# EasyEDA schematic stm32_2.json
TITLE: 最小系统板; REV: 1.0; Date: 2022-09-15; Sheet: 1/1; Company: cxj
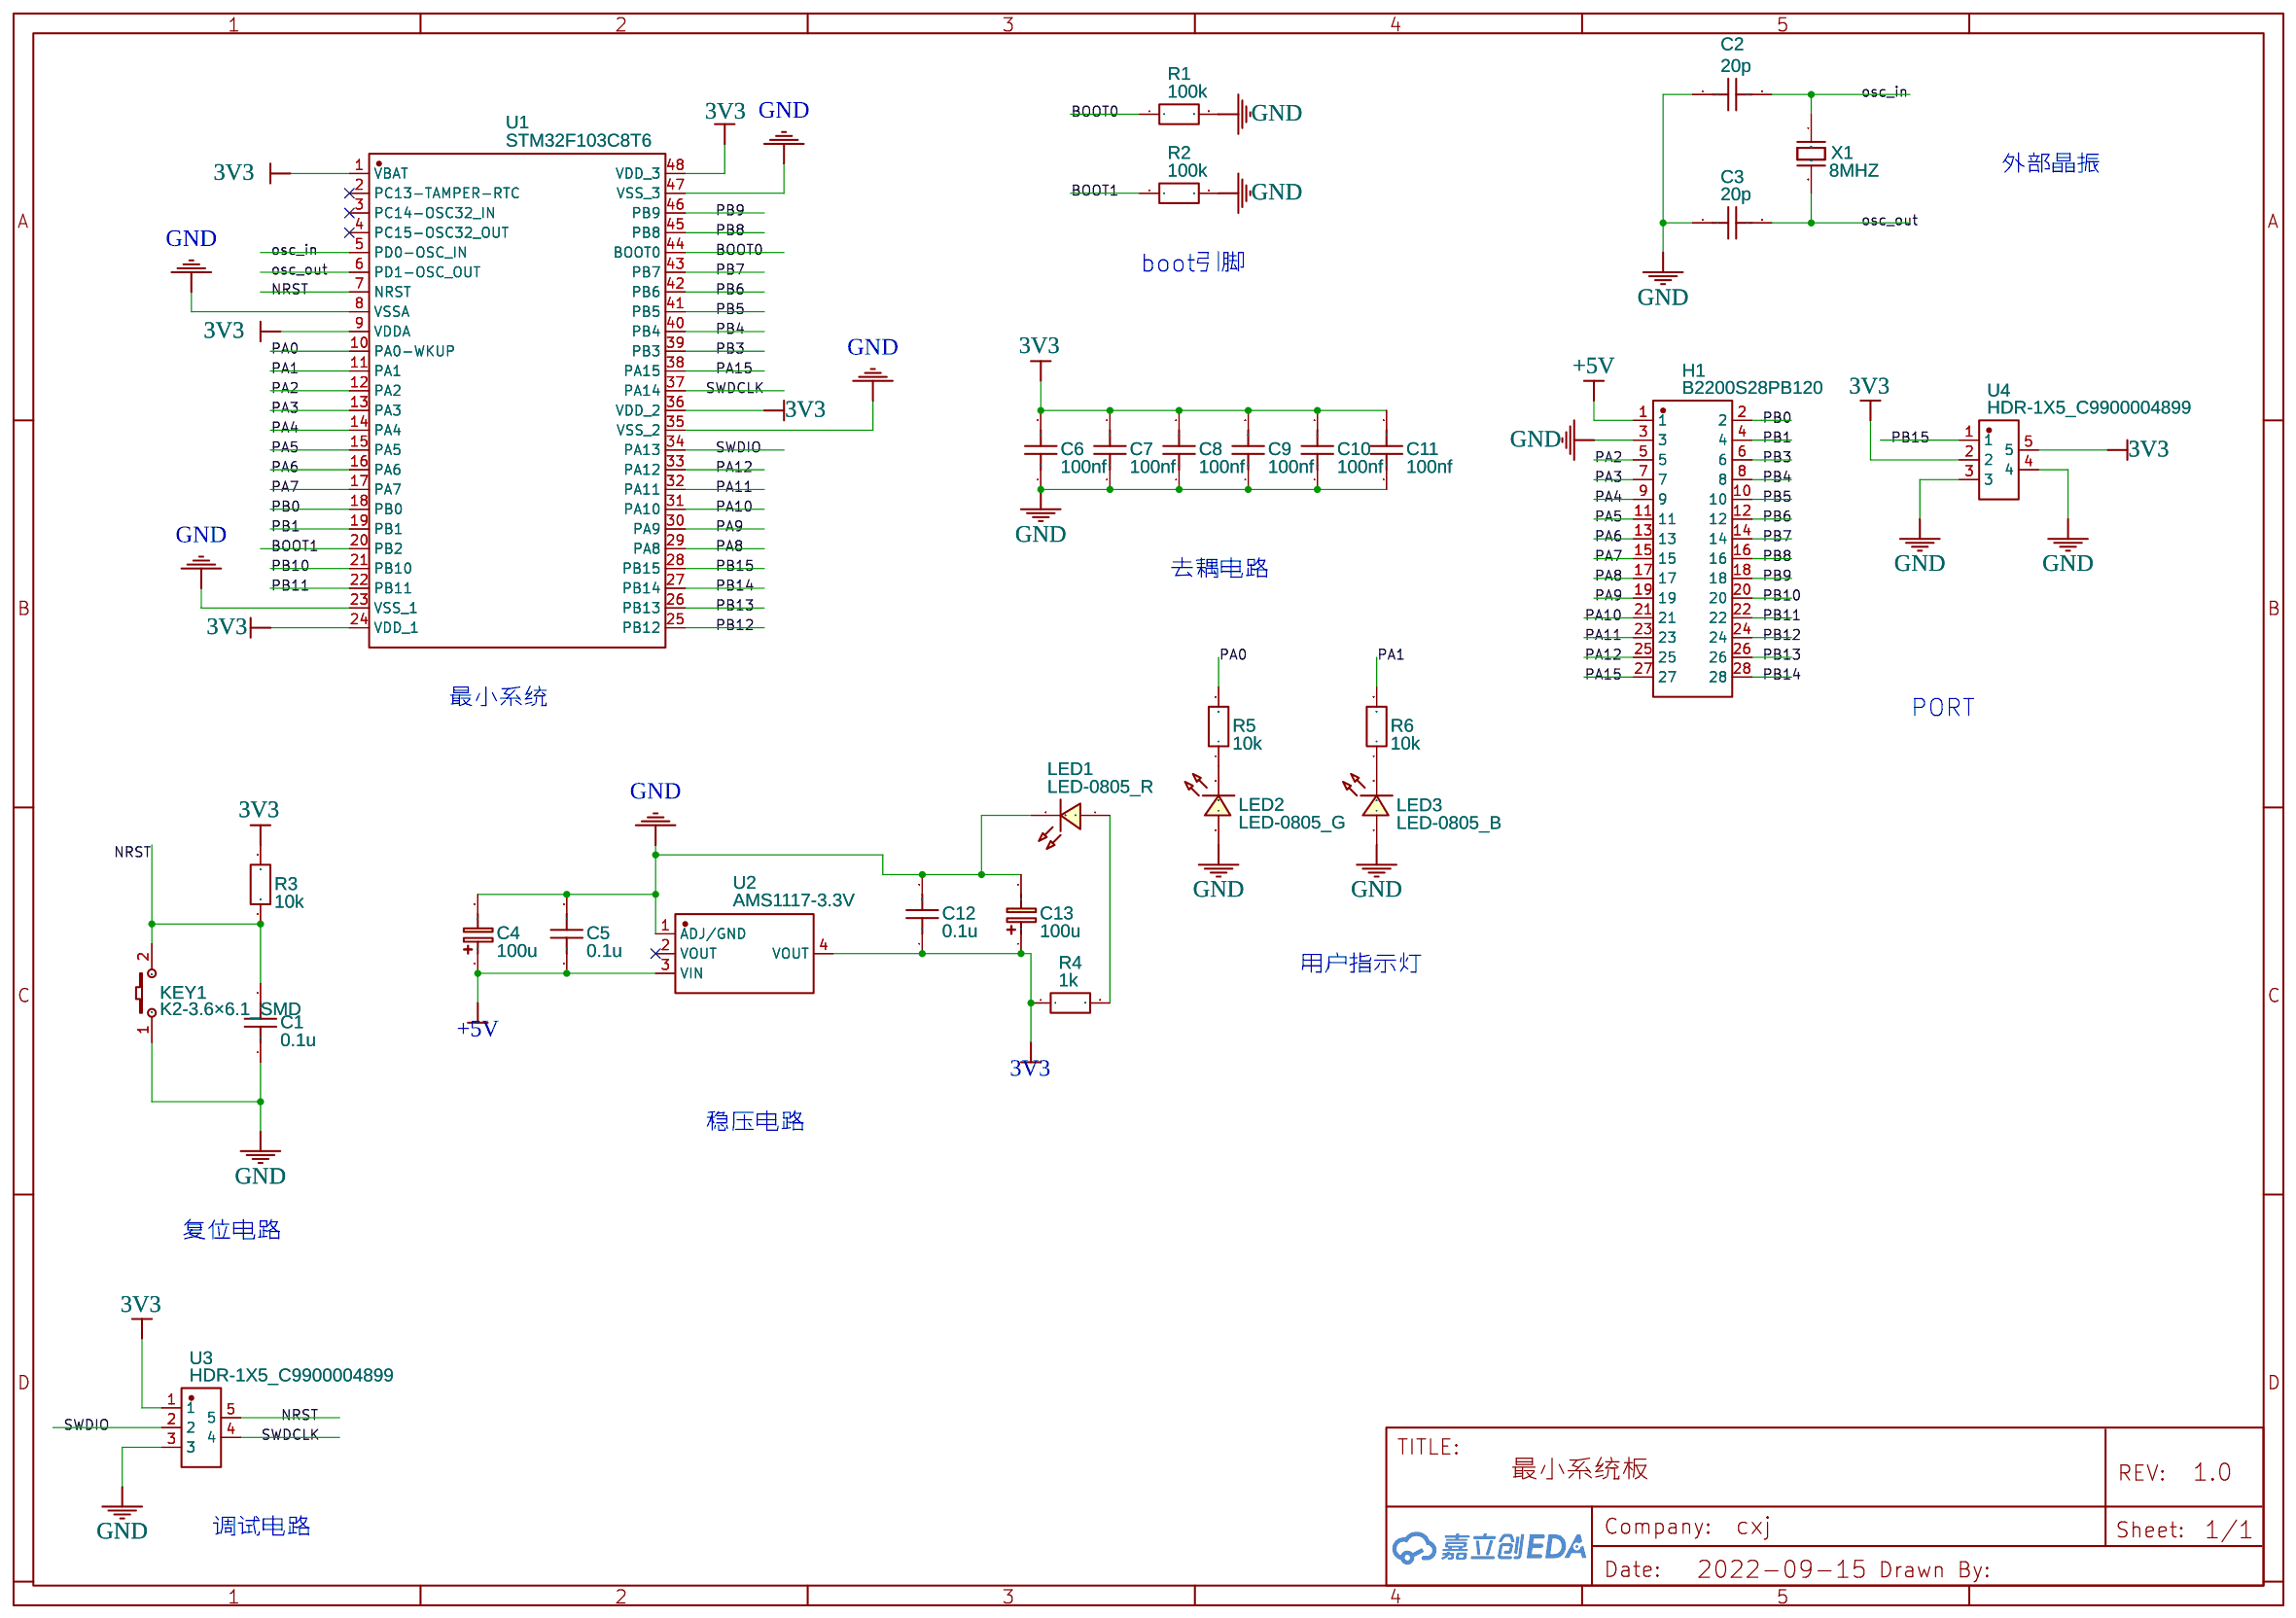
[diagram p0: schematic sheet]

## Parts
C1  0.1u  [C0805]
C2  20p  [C0805]
C3  20p  [C0805]
C4  100u  [CASE-A_3216]
C5  0.1u  [C0805]
C6  100nf  [C0805]
C7  100nf  [C0805]
C8  100nf  [C0805]
C9  100nf  [C0805]
C10  100nf  [C0805]
C11  100nf  [C0805]
C12  0.1u  [C0805]
C13  100u  [CASE-A_3216]
H1  B2200S28PB120  [HDR-TH_28P-P2.54-V-F-R2-C14-S2.54-1]
KEY1  K2-3.6×6.1_SMD  [KEY-SMD_2P-L6.2-W3.6-LS8.0]
LED1  LED-0805_R  [LED0805_RED]
LED2  LED-0805_G  [LED0805_GREEN]
LED3  LED-0805_B  [LED0805_BLUE]
R1  100k  [R0805]
R2  100k  [R0805]
R3  10k  [R0805]
R4  1k  [R0805]
R5  10k  [R0805]
R6  10k  [R0805]
U1  STM32F103C8T6  [LQFP-48_L7.0-W7.0-P0.50-LS9.0-BL]
U2  AMS1117-3.3V  [SOT-223-4_L6.5-W3.5-P2.30-LS7.0-BR]
U3  HDR-1X5_C9900004899  [CONN-TH_5P-P2.50_HDR-1X5]
U4  HDR-1X5_C9900004899  [CONN-TH_5P-P2.50_HDR-1X5]
X1  8MHZ  [OSC-49OSC-YSX-1]

## Library data of the parts
C1-C3 C6-C11 = C_0603_US: Contributor: LCEDA_Lib
C4 C13 = C_Tan_SMD_A_EU: Contributor: LCEDA_Lib
C5 C12 = C_0805_US: Contributor: LCEDA_Lib
H1 = B2200S28PB120: Supplier: LCSC; Supplier Part: C379815; Manufacturer: Shenzhen Cankemeng; Contributor: LCSC; JLCPCB Part Class: Extended Part
KEY1 = K2-3.6×6.1_SMD: Supplier Part: C118141; Supplier: LCSC; Manufacturer Part: K2-1107ST-A4SW-06; Contributor: LCEDA_Lib; 制造商: 韩国韩荣
LED1 = LED-0603_R: Manufacturer: EVERLIGHT(台湾亿光); Manufacturer Part: 19-217/R6C-AL1M2VY/3T; Supplier Part: C72044; Supplier: LCSC; Contributor: LCEDA_01
LED2 = LED-0805_G: Manufacturer: 国星光电; Manufacturer Part: NCD0805G1; Supplier Part: C84260; Contributor: LCEDA_Lib
LED3 = LED-0805_B: Manufacturer: 方舟 ARKLED; Manufacturer Part: D-B080508B1-KS2; Supplier Part: C108412; Contributor: LCEDA_Lib
R1-R3 = R_0603_EU: Contributor: LCEDA_Lib
R4-R6 = R_0805_EU: Contributor: LCEDA_Lib
U1 = STM32F103C8T6: Supplier: LCSC; Manufacturer: STMicroelectronics; Supplier Part: C8734; JLCPCB Part Class: Basic Part
U2 = AMS1117-3.3V: Supplier: LCSC; Supplier Part: C2688239; Manufacturer: WPMtek(维攀微); Contributor: LCSC; JLCPCB Part Class: Extended Part
U3 U4 = HDR-1X5_C9900004899: Supplier: LCSC; Supplier Part: C9900004899; Manufacturer: null; Manufacturer Part: HDR-1X5; link: https://atta.szlcsc.comnull; JLCPCB Part Class: Extended Part; Contributor: lcsc
X1 = 12MHZ: Supplier Part: undefined; Supplier: LCSC; Manufacturer: LCSC; Manufacturer Part: X49SM12MSD2SC; Package Display: No

## Nets
3V3: C6.2 C7.2 C8.2 C9.2 C10.2 C11.2 C12.1 C13.1 R3.2 R4.1 U1.1(VBAT) U1.9(VDDA) U1.24(VDD_1) U1.36(VDD_2) U1.48(VDD_3) U2.4(VOUT) U3.1 U4.2 U4.5
+5V: C4.1 C5.1 H1.1 U2.3(VIN)
GND: C1.1 C2.1 C3.1 C4.2 C5.2 C6.1 C7.1 C8.1 C9.1 C10.1 C11.1 C12.2 C13.2 H1.3 KEY1.1 LED1.2 LED2.1 LED3.1 R1.2 R2.2 U1.8(VSSA) U1.23(VSS_1) U1.35(VSS_2) U1.47(VSS_3) U2.1(ADJ/GND) U3.3 U4.3 U4.4
BOOT0: R1.1 U1.44(BOOT0)
BOOT1: R2.1 U1.20(PB2)
NRST: C1.2 KEY1.2 R3.1 U1.7(NRST) U3.5
osc_in: C2.2 U1.5(PD0-OSC_IN) X1.1(OSC1)
osc_out: C3.2 U1.6(PD1-OSC_OUT) X1.2(OSC2)
PA0: R5.2 U1.10(PA0-WKUP)
PA1: R6.2 U1.11(PA1)
PA2: H1.5 U1.12(PA2)
PA3: H1.7 U1.13(PA3)
PA4: H1.9 U1.14(PA4)
PA5: H1.11 U1.15(PA5)
PA6: H1.13 U1.16(PA6)
PA7: H1.15 U1.17(PA7)
PA8: H1.17 U1.29(PA8)
PA9: H1.19 U1.30(PA9)
PA10: H1.21 U1.31(PA10)
PA11: H1.23 U1.32(PA11)
PA12: H1.25 U1.33(PA12)
PA15: H1.27 U1.38(PA15)
PB0: H1.2 U1.18(PB0)
PB1: H1.4 U1.19(PB1)
PB3: H1.6 U1.39(PB3)
PB4: H1.8 U1.40(PB4)
PB5: H1.10 U1.41(PB5)
PB6: H1.12 U1.42(PB6)
PB7: H1.14 U1.43(PB7)
PB8: H1.16 U1.45(PB8)
PB9: H1.18 U1.46(PB9)
PB10: H1.20 U1.21(PB10)
PB11: H1.22 U1.22(PB11)
PB12: H1.24 U1.25(PB12)
PB13: H1.26 U1.26(PB13)
PB14: H1.28 U1.27(PB14)
PB15: U1.28(PB15) U4.1
SWDCLK: U1.37(PA14) U3.4
SWDIO: U1.34(PA13) U3.2
Net-(LED1-1): LED1.1 R4.2
Net-(LED2-2): LED2.2 R5.1
Net-(LED3-2): LED3.2 R6.1

Not connected (* = marked no-connect by the designer): U1 2(PC13-TAMPER-RTC)* 3(PC14-OSC32_IN)* 4(PC15-OSC32_OUT)*; U2 2(VOUT)*

## Notes on the sheet
- 外部晶振
- boot引脚
- 去耦电路
- 最小系统
- PORT
- 用户指示灯
- 稳压电路
- 复位电路
- 调试电路
